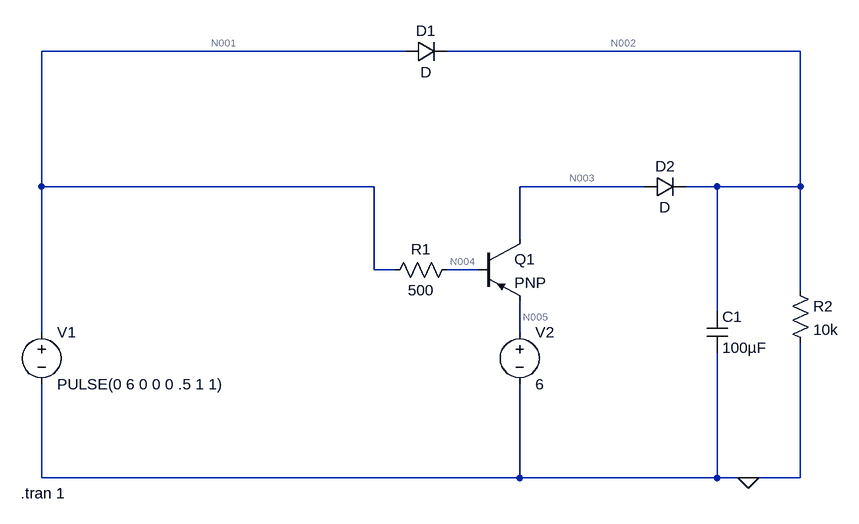
[diagram p0: schematic Power Supply v3.asc]
Power Supply v3.asc, the LTspice schematic file:
Version 4
SHEET 1 2212 680
WIRE 1024 -256 464 -256
WIRE 1632 -256 1088 -256
WIRE 464 -48 464 -256
WIRE 976 -48 464 -48
WIRE 1392 -48 1200 -48
WIRE 1504 -48 1456 -48
WIRE 1632 -48 1632 -256
WIRE 1632 -48 1504 -48
WIRE 1200 32 1200 -48
WIRE 976 80 976 -48
WIRE 1008 80 976 80
WIRE 1136 80 1088 80
WIRE 1632 112 1632 -48
WIRE 1504 144 1504 -48
WIRE 464 176 464 -48
WIRE 1200 176 1200 128
WIRE 464 400 464 256
WIRE 1200 400 1200 256
WIRE 1200 400 464 400
WIRE 1504 400 1504 208
WIRE 1504 400 1200 400
WIRE 1552 400 1504 400
WIRE 1632 400 1632 192
WIRE 1632 400 1552 400
FLAG 1552 400 0
SYMBOL voltage 464 160 R0
WINDOW 123 0 0 Left 2
WINDOW 39 0 0 Left 2
SYMATTR InstName V1
SYMATTR Value PULSE(0 6 0 0 0 .5 1 1)
SYMBOL voltage 1200 160 R0
WINDOW 123 0 0 Left 2
WINDOW 39 0 0 Left 2
SYMATTR InstName V2
SYMATTR Value 6
SYMBOL pnp 1136 32 R0
SYMATTR InstName Q1
SYMBOL cap 1488 144 R0
SYMATTR InstName C1
SYMATTR Value 100µF
SYMBOL res 1104 64 R90
WINDOW 0 0 56 VBottom 2
WINDOW 3 32 56 VTop 2
SYMATTR InstName R1
SYMATTR Value 500
SYMBOL res 1616 96 R0
SYMATTR InstName R2
SYMATTR Value 10k
SYMBOL diode 1024 -240 R270
WINDOW 0 32 32 VTop 2
WINDOW 3 0 32 VBottom 2
SYMATTR InstName D1
SYMBOL diode 1392 -32 R270
WINDOW 0 32 32 VTop 2
WINDOW 3 0 32 VBottom 2
SYMATTR InstName D2
TEXT 432 424 Left 2 !.tran 1

The netlist it stands for:
* Power Supply v3.asc
V1 N001 0 PULSE(0 6 0 0 0 .5 1 1)
V2 N005 0 6
Q1 N003 N004 N005 0 PNP
C1 N002 0 100µF
R1 N004 N001 500
R2 N002 0 10k
D1 N001 N002 D
D2 N003 N002 D
.model D D
.lib standard.dio
.model NPN NPN
.model PNP PNP
.lib standard.bjt
.tran 1
.backanno
.end

* Results of the author's LTspice run, read from the files saved beside the schematic
* Operating Point, zero values left out:
*   V(n005) = 6 V
*   V(n003) = 5.981 V
*   V(n004) = 5.147 V
*   V(n002) = 5.342 V
*   Ic(Q1) = -534.2 µA
*   Ib(Q1) = -10.29 mA
*   Ie(Q1) = 10.83 mA
*   I(D2) = 534.2 µA
*   I(D1) = -5.352 pA
*   I(R2) = 534.2 µA
*   I(R1) = 10.29 mA
*   I(V2) = -10.83 mA
*   I(V1) = 10.29 mA
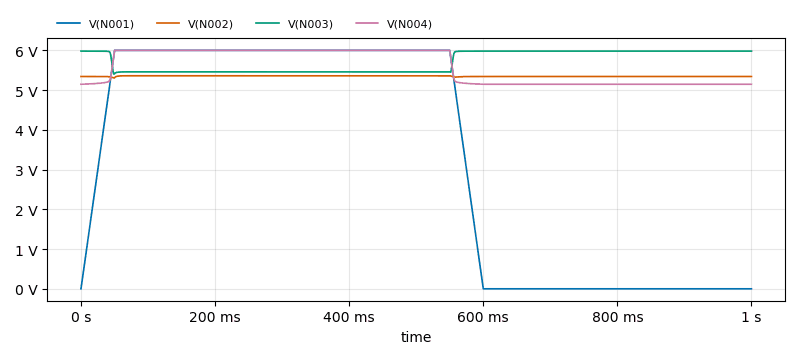
[diagram p1: Transient Analysis of Power Supply v3.asc, plotted from the saved traces]
* Transient Analysis, 1 run:
*   V(N001): min 0 V, max 6 V, average 3.3 V, rms 4.382 V, last 0 V
*   V(N002): min 5.305 V, max 5.361 V, average 5.351 V, rms 5.351 V, last 5.342 V
*   V(N003): min 5.404 V, max 5.981 V, average 5.716 V, rms 5.721 V, last 5.981 V
*   V(N004): min 5.147 V, max 6 V, average 5.582 V, rms 5.598 V, last 5.147 V